# EAGLE schematic TSOP-II-44_v3 (EAGLE 7.4.0)
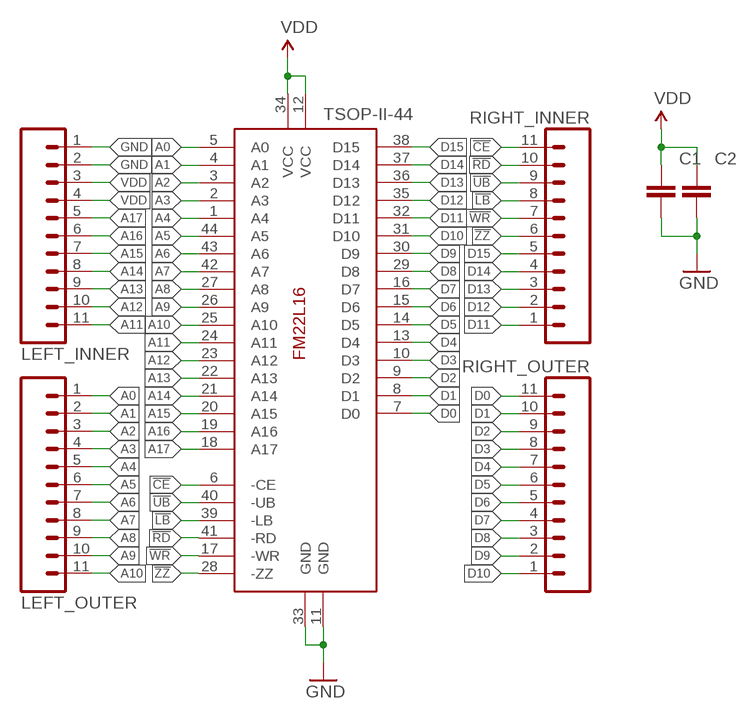
[diagram p0: schematic, sheet 1]

## Parts
C1  CAPACITOR_NPOL-0603  [C603]
C2  CAPACITOR_NPOL-0603  [C603]
LEFT_INNER  M11PTH  [1X11]
LEFT_OUTER  M11PTH  [1X11]
RIGHT_INNER  M11PTH  [1X11]
RIGHT_OUTER  M11PTH  [1X11]
TSOP-II-44  FM22L16-TG  [TSOPII-44]

## Nets
!CE: RIGHT_INNER.11 TSOP-II-44.6(-CE)
!LB: RIGHT_INNER.8 TSOP-II-44.39(-LB)
!RD: RIGHT_INNER.10 TSOP-II-44.41(-RD)
!UB: RIGHT_INNER.9 TSOP-II-44.40(-UB)
!WR: RIGHT_INNER.7 TSOP-II-44.17(-WR)
!ZZ: RIGHT_INNER.6 TSOP-II-44.28(-ZZ)
A0: LEFT_OUTER.1 TSOP-II-44.5(A0)
A1: LEFT_OUTER.2 TSOP-II-44.4(A1)
A2: LEFT_OUTER.3 TSOP-II-44.3(A2)
A3: LEFT_OUTER.4 TSOP-II-44.2(A3)
A4: LEFT_OUTER.5 TSOP-II-44.1(A4)
A5: LEFT_OUTER.6 TSOP-II-44.44(A5)
A6: LEFT_OUTER.7 TSOP-II-44.43(A6)
A7: LEFT_OUTER.8 TSOP-II-44.42(A7)
A8: LEFT_OUTER.9 TSOP-II-44.27(A8)
A9: LEFT_OUTER.10 TSOP-II-44.26(A9)
A10: LEFT_OUTER.11 TSOP-II-44.25(A10)
A11: LEFT_INNER.11 TSOP-II-44.24(A11)
A12: LEFT_INNER.10 TSOP-II-44.23(A12)
A13: LEFT_INNER.9 TSOP-II-44.22(A13)
A14: LEFT_INNER.8 TSOP-II-44.21(A14)
A15: LEFT_INNER.7 TSOP-II-44.20(A15)
A16: LEFT_INNER.6 TSOP-II-44.19(A16)
A17: LEFT_INNER.5 TSOP-II-44.18(A17)
D0: RIGHT_OUTER.11 TSOP-II-44.7(D0)
D1: RIGHT_OUTER.10 TSOP-II-44.8(D1)
D2: RIGHT_OUTER.9 TSOP-II-44.9(D2)
D3: RIGHT_OUTER.8 TSOP-II-44.10(D3)
D4: RIGHT_OUTER.7 TSOP-II-44.13(D4)
D5: RIGHT_OUTER.6 TSOP-II-44.14(D5)
D6: RIGHT_OUTER.5 TSOP-II-44.15(D6)
D7: RIGHT_OUTER.4 TSOP-II-44.16(D7)
D8: RIGHT_OUTER.3 TSOP-II-44.29(D8)
D9: RIGHT_OUTER.2 TSOP-II-44.30(D9)
D10: RIGHT_OUTER.1 TSOP-II-44.31(D10)
D11: RIGHT_INNER.1 TSOP-II-44.32(D11)
D12: RIGHT_INNER.2 TSOP-II-44.35(D12)
D13: RIGHT_INNER.3 TSOP-II-44.36(D13)
D14: RIGHT_INNER.4 TSOP-II-44.37(D14)
D15: RIGHT_INNER.5 TSOP-II-44.38(D15)
GND: C1.2 C2.2 LEFT_INNER.1 LEFT_INNER.2 TSOP-II-44.11(GND) TSOP-II-44.33(GND)
VDD: C1.1 C2.1 LEFT_INNER.3 LEFT_INNER.4 TSOP-II-44.12(VCC) TSOP-II-44.34(VCC)

## Library data of the parts
C1 C2 = dp_devices:CAPACITOR_NPOL: Non-Polarized capacitor in various packages
LEFT_INNER LEFT_OUTER RIGHT_INNER RIGHT_OUTER = SparkFun-Connectors:M11: Header 11 Standard 11-pin 0.1" header. Use with straight break away headers (SKU : PRT-00116), right angle break away headers (PRT-00553), swiss pins (PRT-00743), machine pins (PRT-00117), and female headers (PRT-00115).
TSOP-II-44 = ramtron:FM22L16: NVRAM 256k x 16 or 512k x 8